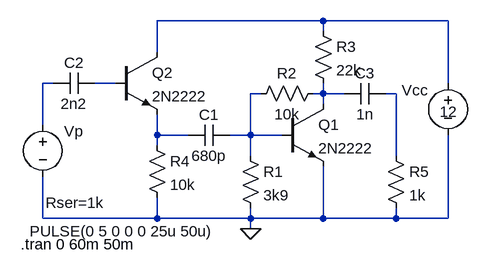
[diagram p0: schematic frecx2.asc]
frecx2.asc, the LTspice schematic file:
Version 4
SHEET 1 880 680
WIRE 304 -16 48 -16
WIRE 496 -16 304 -16
WIRE 304 0 304 -16
WIRE 48 32 48 -16
WIRE -112 80 -128 80
WIRE -16 80 -48 80
WIRE 496 80 496 -16
WIRE 208 96 192 96
WIRE 304 96 304 80
WIRE 304 96 288 96
WIRE 336 96 304 96
WIRE 416 96 400 96
WIRE 304 112 304 96
WIRE -128 144 -128 80
WIRE 48 160 48 128
WIRE 96 160 48 160
WIRE 192 160 192 96
WIRE 192 160 160 160
WIRE 240 160 192 160
WIRE 48 176 48 160
WIRE 192 192 192 160
WIRE 416 192 416 96
WIRE -128 288 -128 224
WIRE 48 288 48 256
WIRE 48 288 -128 288
WIRE 192 288 192 272
WIRE 192 288 48 288
WIRE 304 288 304 208
WIRE 304 288 192 288
WIRE 416 288 416 272
WIRE 416 288 304 288
WIRE 496 288 496 160
WIRE 496 288 416 288
WIRE 192 304 192 288
FLAG 192 304 0
SYMBOL npn2 240 112 R0
SYMATTR InstName Q1
SYMATTR Value 2N2222
SYMBOL res 176 176 R0
SYMATTR InstName R1
SYMATTR Value 3k9
SYMBOL res 304 80 R90
WINDOW 0 0 56 VBottom 0
WINDOW 3 32 56 VTop 0
SYMATTR InstName R2
SYMATTR Value 10k
SYMBOL res 288 -16 R0
SYMATTR InstName R3
SYMATTR Value 22k
SYMBOL voltage 496 64 R0
WINDOW 0 -71 27 Left 0
WINDOW 3 -13 60 Left 0
SYMATTR InstName Vcc
SYMATTR Value 12
SYMBOL npn2 -16 32 R0
SYMATTR InstName Q2
SYMATTR Value 2N2222
SYMBOL res 32 160 R0
SYMATTR InstName R4
SYMATTR Value 10k
SYMBOL cap 160 144 R90
WINDOW 0 0 32 VBottom 0
WINDOW 3 32 32 VTop 0
SYMATTR InstName C1
SYMATTR Value 680p
SYMBOL voltage -128 128 R0
WINDOW 0 33 26 Left 0
WINDOW 3 -20 180 Left 0
WINDOW 123 0 0 Left 0
WINDOW 39 4 136 Left 0
SYMATTR InstName Vp
SYMATTR Value PULSE(0 5 0 0 0 25u 50u)
SYMATTR SpiceLine Rser=1k
SYMBOL cap -48 64 R90
WINDOW 0 0 32 VBottom 0
WINDOW 3 32 32 VTop 0
SYMATTR InstName C2
SYMATTR Value 2n2
SYMBOL res 400 176 R0
SYMATTR InstName R5
SYMATTR Value 1k
SYMBOL cap 400 80 R90
WINDOW 0 0 32 VBottom 0
WINDOW 3 32 32 VTop 0
SYMATTR InstName C3
SYMATTR Value 1n
TEXT -162 328 Left 0 !.tran 0 60m 50m

The netlist it stands for:
* frecx2.asc
Q1 N005 N004 0 0 2N2222
R1 N004 0 3k9
R2 N005 N004 10k
R3 N001 N005 22k
Vcc N001 0 12
Q2 N001 N003 N007 0 2N2222
R4 N007 0 10k
C1 N004 N007 680p
Vp N002 0 PULSE(0 5 0 0 0 25u 50u) Rser=1k
C2 N003 N002 2n2
R5 N006 0 1k
C3 N006 N005 1n
.model NPN NPN
.model PNP PNP
.lib standard.bjt
.tran 0 60m 50m
.backanno
.end